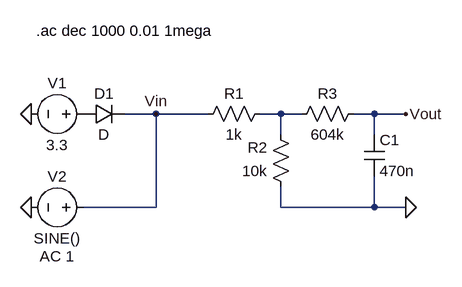
[diagram p0: schematic LDR-LP-SunSensor.asc]
LDR-LP-SunSensor.asc, the LTspice schematic file:
Version 4
SHEET 1 880 680
WIRE 224 128 176 128
WIRE 304 128 224 128
WIRE 416 128 384 128
WIRE 448 128 416 128
WIRE 560 128 528 128
WIRE 608 128 560 128
WIRE 416 160 416 128
WIRE 560 160 560 128
WIRE 224 272 224 128
WIRE 224 272 112 272
WIRE 416 272 416 240
WIRE 560 272 560 224
WIRE 560 272 416 272
WIRE 608 272 560 272
FLAG 608 128 Vout
FLAG 224 128 Vin
FLAG 32 128 0
FLAG 32 272 0
FLAG 608 272 0
SYMBOL voltage 128 128 R90
WINDOW 0 -32 56 VBottom 2
WINDOW 3 32 56 VTop 2
WINDOW 123 0 0 Left 0
WINDOW 39 0 0 Left 0
SYMATTR InstName V1
SYMATTR Value 3.3
SYMBOL voltage 128 272 R90
WINDOW 0 -32 56 VBottom 2
WINDOW 3 32 56 VTop 2
WINDOW 123 60 56 VTop 2
WINDOW 39 0 0 Left 0
SYMATTR InstName V2
SYMATTR Value SINE()
SYMATTR Value2 AC 1
SYMBOL res 400 112 R90
WINDOW 0 0 56 VBottom 2
WINDOW 3 32 56 VTop 2
SYMATTR InstName R1
SYMATTR Value 1k
SYMBOL res 432 256 R180
WINDOW 0 36 76 Left 2
WINDOW 3 36 40 Left 2
SYMATTR InstName R2
SYMATTR Value 10k
SYMBOL res 432 144 R270
WINDOW 0 32 56 VTop 2
WINDOW 3 0 56 VBottom 2
SYMATTR InstName R3
SYMATTR Value 604k
SYMBOL cap 544 160 R0
SYMATTR InstName C1
SYMATTR Value 470n
SYMBOL diode 112 144 R270
WINDOW 0 32 32 VTop 2
WINDOW 3 0 32 VBottom 2
SYMATTR InstName D1
TEXT 40 0 Left 2 !.ac dec 1000 0.01 1mega

The netlist it stands for:
* LDR-LP-SunSensor.asc
V1 P001 0 3.3
V2 Vin 0 SINE() AC 1
R1 N001 Vin 1k
R2 0 N001 10k
R3 N001 Vout 604k
C1 Vout 0 470n
D1 P001 Vin D
.model D D
.lib standard.dio
.ac dec 1000 0.01 1mega
.backanno
.end